# Altium schematic sheet CH340G.SchDoc
size A
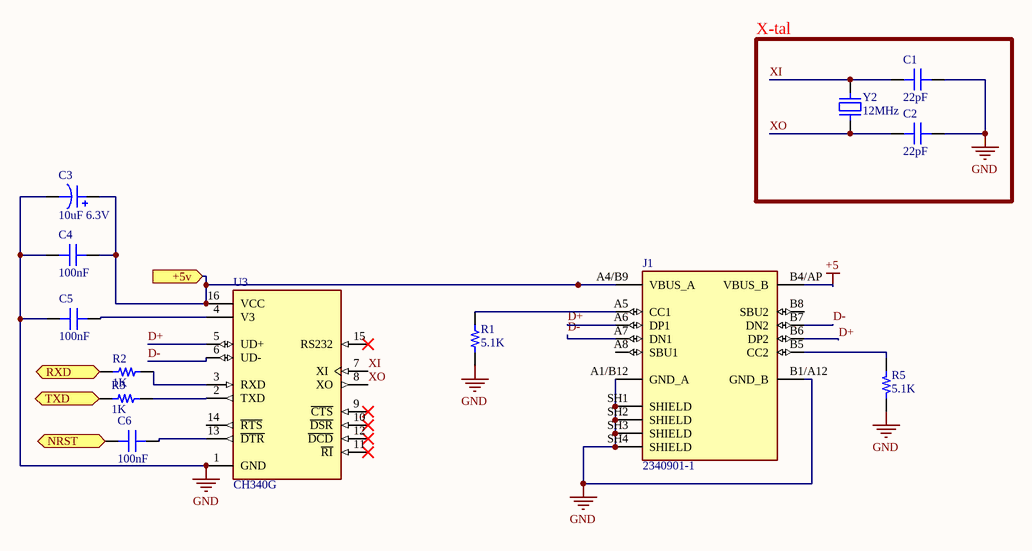
[diagram p0: CH340G.SchDoc]

## Parts
C1  22pF  [CAP 0805_2012]
C2  22pF  [CAP 0805_2012]
C3  10uF 6.3V  [CAP ALTH D8 L3.5 H12.5]
C4  100nF  [CAP 0805_2012]
C5  100nF  [CAP 0805_2012]
C6  100nF  [CAP 0805_2012]
J1  2340901-1  [TE_2340901-1]
R1  5.1K  [RES 0805_2012]
R2  1K  [RES 0805_2012]
R3  1K  [RES 0805_2012]
R5  5.1K  [RES 0805_2012]
U3  CH340G  [SOIC127P600X180-16N]
Y2  12MHz  [HC-49S SMD]

## Blocks framed on the sheet
X-tal: C1 C2 Y2

## Ports
+5v (in), NRST (bidir), RXD (bidir), TXD (bidir)

## Nets
+5: J1.B4/AP(VBUS_B)
GND: C1.2 C2.2 C3.2 C4.2 C5.1 J1.A1/B12(GND_A) J1.B1/A12(GND_B) J1.SH1(SHIELD) J1.SH2(SHIELD) J1.SH3(SHIELD) J1.SH4(SHIELD) R1.1 R5.1 U3.1(GND)
+5v: C3.1 C4.1 J1.A4/B9(VBUS_A) U3.16(VCC) ; port +5v
D+: J1.A6(DP1) J1.B6(DP2) U3.5(UD+)
D-: J1.A7(DN1) J1.B7(DN2) U3.6(UD-)
NRST: C6.1 ; port NRST
RXD: R2.1 ; port RXD
TXD: R3.1 ; port TXD
XI: C1.1 U3.7(XI) Y2.2
XO: C2.1 U3.8(XO) Y2.1
NetC5_2: C5.2 U3.4(V3)
NetC6_2: C6.2 U3.13(~{DTR})
NetJ1_A5: J1.A5(CC1) R1.2
NetJ1_B5: J1.B5(CC2) R5.2
NetR2_2: R2.2 U3.3(RXD)
NetR3_2: R3.2 U3.2(TXD)

Not connected (* = marked no-connect by the designer): J1 A8(SBU1) B8(SBU2); U3 9(~{CTS})* 10(~{DSR})* 11(~{RI})* 12(~{DCD})* 14(~{RTS}) 15(RS232)*

## Library data of the parts
C1 C2 = Cap 0805: SMT Capacitor; VALUE: 100nF
C3 = Cap Alu TH D8mm L3.5mm H12.5mm: TH Aluminum Polymer Capacitor; VALUE: 10uF 6.3V
C4-C6 = Cap 0805: SMT Capacitor; VALUE: 100nF
J1 = 2340901-1: USB Type C 2.0 Conn Rec Mid-Mount One Ro; MF: TE Connectivity; SnapEDA_Link: https://www.snapeda.com/parts/2340901-1/TE+Connectivity/view-part/?ref=snap; Package: None; Value: *; MP: 2340901-1; Check_prices: https://www.snapeda.com/parts/2340901-1/TE+Connectivity/view-part/?ref=eda
R1 R5 = Res 0805: SMT Resistor; VALUE: 1K
R2 R3 = Res 0805: SMT Resistor; VALUE: 1K
U3 = CH340G: USB Interface Integrated Circuit; MF: WCH; Value: *; SnapEDA_Link: https://www.snapeda.com/parts/Ch340G/WCH/view-part/?ref=snap; MP: Ch340G; Check_prices: https://www.snapeda.com/parts/Ch340G/WCH/view-part/?ref=eda; Availability: Not in stock; Price: None; Package: None
Y2 = Crystal HC-49S SMD 8MHz: SMT Crystal; PartNumber: ABLS-8.000MHZ-K4T